# Altium schematic sheet Hierarchy.SchDoc
size A4
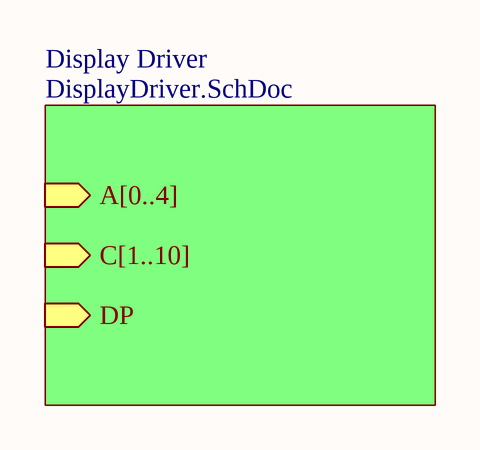
[diagram p0: Hierarchy.SchDoc]

## Sub-sheets
Display Driver = DisplayDriver.SchDoc: A[0..4] (in), C[1..10] (in), DP (in)